# Altium schematic sheet ScheBTL.SchDoc
size A4; SheetNumber: 1; SheetTotal: 1
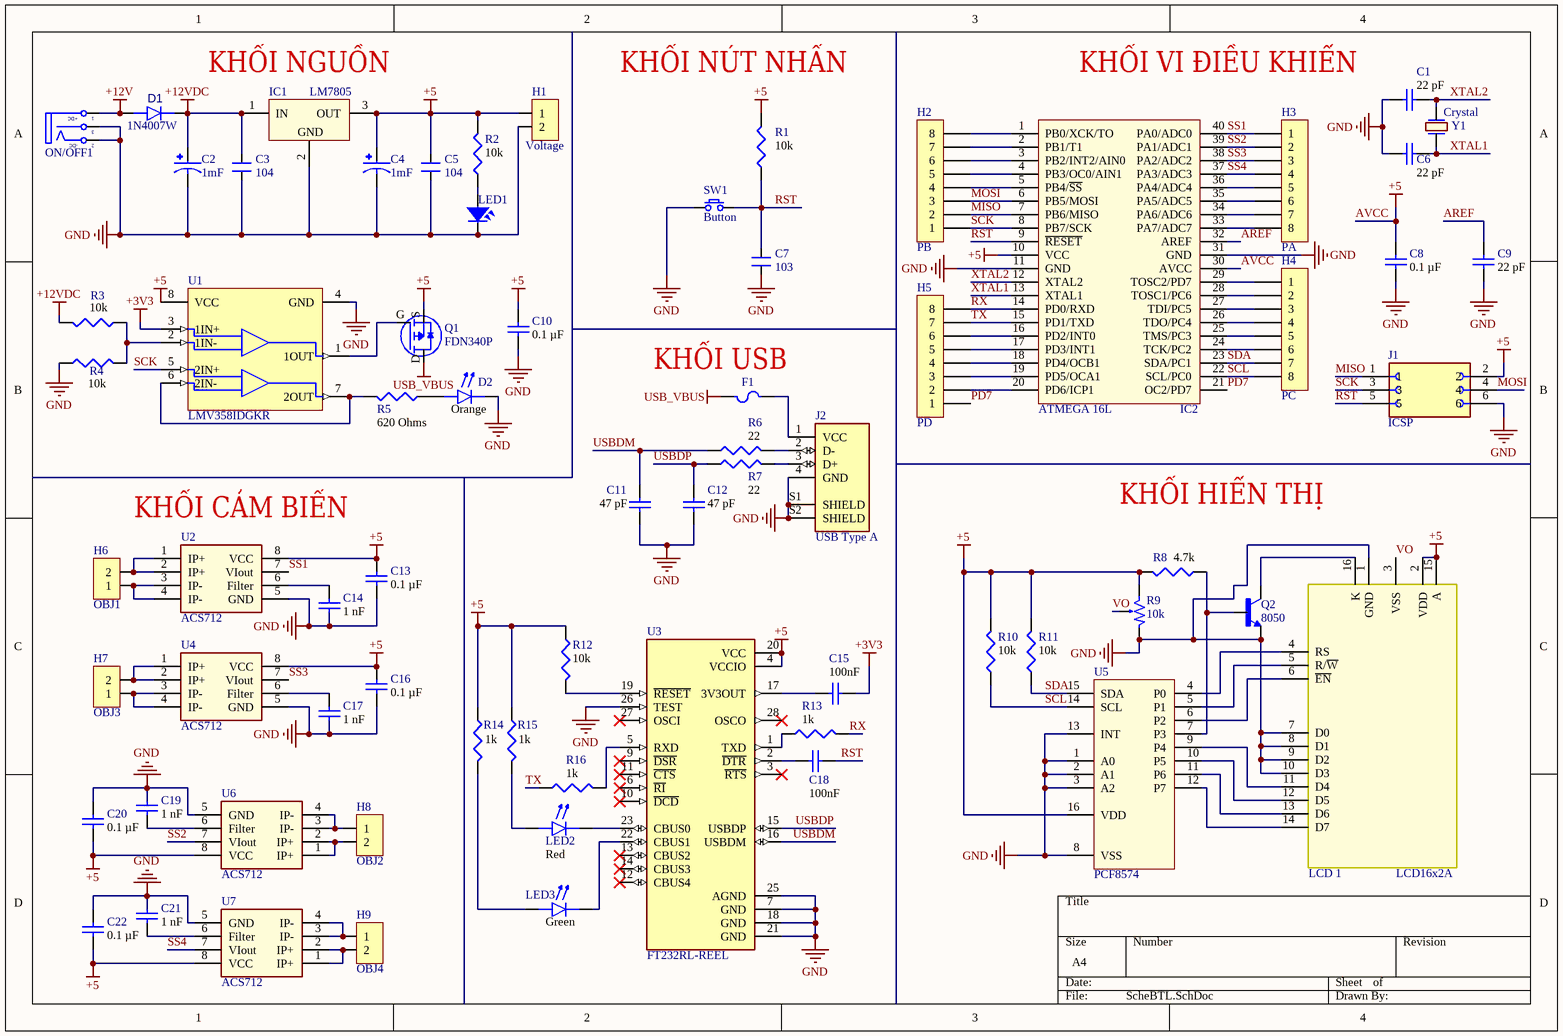
[diagram p0: ScheBTL.SchDoc]

## Parts
C1  Capacitance: 22 pF  [0805 (2012 Metric)]  (hidden comment: Capacitor)
C2  1mF  [CAP_16SVPF1000M]
C3  104  [CN2]
C4  1mF  [CAP_16SVPF1000M]
C5  104  [CN2]
C6  Capacitance: 22 pF  [0805 (2012 Metric)]  (hidden comment: Capacitor)
C7  103  [CN1.5]
C8  Capacitance: 0.1 µF  [0805 (2012 Metric)]  (hidden comment: Capacitor)
C9  Capacitance: 22 pF  [0805 (2012 Metric)]  (hidden comment: Capacitor)
C10  Capacitance: 0.1 µF  [0805 (2012 Metric)]  (hidden comment: Capacitor)
C11  Capacitance: 47 pF  [0805 (2012 Metric)]  (hidden comment: Capacitor)
C12  Capacitance: 47 pF  [0805 (2012 Metric)]  (hidden comment: Capacitor)
C13  Capacitance: 0.1 µF  [0805 (2012 Metric)]  (hidden comment: Capacitor)
C14  Capacitance: 1 nF  [0805 (2012 Metric)]  (hidden comment: Capacitor)
C15  Capacitance: 100nF  [0805 (2012 Metric)]  (hidden comment: Capacitor)
C16  Capacitance: 0.1 µF  [0805 (2012 Metric)]  (hidden comment: Capacitor)
C17  Capacitance: 1 nF  [0805 (2012 Metric)]  (hidden comment: Capacitor)
C18  Capacitance: 100nF  [0805 (2012 Metric)]  (hidden comment: Capacitor)
C19  Capacitance: 1 nF  [0805 (2012 Metric)]  (hidden comment: Capacitor)
C20  Capacitance: 0.1 µF  [0805 (2012 Metric)]  (hidden comment: Capacitor)
C21  Capacitance: 1 nF  [0805 (2012 Metric)]  (hidden comment: Capacitor)
C22  Capacitance: 0.1 µF  [0805 (2012 Metric)]  (hidden comment: Capacitor)
D1  Part Number: 1N4007W  [DO-204AL, DO-41, Axial]  (hidden comment: Diode)
D2  Color: Orange  [0805 (2012 Metric) Orange]  (hidden comment: LED Indication - Discrete)
F1  Fuse  [1812 (4532 Metric), Concave]  (value not drawn)
H1  Voltage  [Wire to Board, Pitch 5.00mm]
H2  PB  [Female, Through Hole, Pitch 2.54mm]
H3  PA  [Female, Through Hole, Pitch 2.54mm]
H4  PC  [Female, Through Hole, Pitch 2.54mm]
H5  PD  [Female, Through Hole, Pitch 2.54mm]
H6  OBJ1  [Wire to Board, Pitch 5.00mm]
H7  OBJ3  [Wire to Board, Pitch 5.00mm]
H8  OBJ2  [Wire to Board, Pitch 5.00mm]
H9  OBJ4  [Wire to Board, Pitch 5.00mm]
IC1  LM7805  [QTO-220]
IC2  ATMEGA 16L  [DIP40/W0.6]
J1  ICSP  [SULLINS_PPTC032LFBN-RC]
J2  USB Type A  [GCT_USB1130-15-A_REVA]
LCD_1  LCD16x2A  [LCD16X2]
LED1  LED  [LED-3]  (value not drawn)
LED2  Color: Red  [0805 (2012 Metric) Red]  (hidden comment: LED Indication - Discrete)
LED3  Color: Green  [0805 (2012 Metric) Green]  (hidden comment: LED Indication - Discrete)
ON/OFF1  POWER  [DC-IN]  (value not drawn)
Q1  Part Number: FDN340P  [TO-236-3, SC-59, SOT-23-3]  (hidden comment: Mosfet)
Q2  8050  [TRANS_SS8050-G]
R1  Resistance: 10k  [0805 (2012 Metric)]  (hidden comment: Resistor)
R2  Resistance: 10k  [0805 (2012 Metric)]  (hidden comment: Resistor)
R3  Resistance: 10k  [0805 (2012 Metric)]  (hidden comment: Resistor)
R4  Resistance: 10k  [0805 (2012 Metric)]  (hidden comment: Resistor)
R5  Resistance: 620 Ohms  [0805 (2012 Metric)]  (hidden comment: Resistor)
R6  Resistance: 22  [0805 (2012 Metric)]  (hidden comment: Resistor)
R7  Resistance: 22  [0805 (2012 Metric)]  (hidden comment: Resistor)
R8  Resistance: 4.7k  [0805 (2012 Metric)]  (hidden comment: Resistor)
R9  10k  [VR]
R10  Resistance: 10k  [0805 (2012 Metric)]  (hidden comment: Resistor)
R11  Resistance: 10k  [0805 (2012 Metric)]  (hidden comment: Resistor)
R12  Resistance: 10k  [0805 (2012 Metric)]  (hidden comment: Resistor)
R13  Resistance: 1k  [0805 (2012 Metric)]  (hidden comment: Resistor)
R14  Resistance: 1k  [0805 (2012 Metric)]  (hidden comment: Resistor)
R15  Resistance: 1k  [0805 (2012 Metric)]  (hidden comment: Resistor)
R16  Resistance: 1k  [0805 (2012 Metric)]  (hidden comment: Resistor)
SW1  Button  [SW/2/DIP]
U1  Part Number: LMV358IDGKR  [8-TSSOP, 8-MSOP]  (hidden comment: LMV358)
U2  ACS712  [SOIC-8]
U3  FT232RL-REEL  [SOP65P780X200-28N]
U4  ACS712  [SOIC-8]
U5  PCF8574  [SO16/PCF8574AT]
U6  ACS712  [SOIC-8]
U7  ACS712  [SOIC-8]
Y1  Crystal  [Crystal HC49S DIP]

## Nets
+3V3: C15.1 U1.3(1IN+)
+12V: D1.2(A) ON/OFF1.1(T)
+12VDC: C2.1 C3.2 D1.1(K) IC1.1(IN) R3.2
AVCC: C4.1 C5.2 C8.2 C10.2 C13.2 C16.2 C20.1 C22.1 H1.1 IC1.3(OUT) IC2.10(VCC) IC2.30(AVCC) J1.2 LCD_1.2(VDD) LCD_1.15(A) Q1.S R1.2 R2.2 R8.2 R9.3 R10.2 R11.2 R12.1 R14.1 R15.1 U1.8(VCC) U2.8(VCC) U3.4(VCCIO) U3.20(VCC) U4.8(VCC) U5.16(VDD) U6.8(VCC) U7.8(VCC)  [also labelled +5]
GND: C1.2 C2.2 C3.1 C4.2 C5.1 C6.2 C7.1 C8.1 C9.1 C10.1 C11.1 C12.1 C13.1 C14.1 C16.1 C17.1 C19.2 C20.2 C21.2 C22.2 D2.1(K) H1.2 IC1.2(GND) IC2.11(GND) IC2.31(GND) J1.6 J2.4(GND) J2.S1(SHIELD) J2.S2(SHIELD) LCD_1.1(GND) LCD_1.7(D0) LCD_1.8(D1) LCD_1.9(D2) LCD_1.10(D3) LED1.2 ON/OFF1.2(TN) ON/OFF1.3(S) Q2.2(E) R4.1 R9.1 SW1.1 U1.4(GND) U2.5(GND) U3.7(GND) U3.18(GND) U3.21(GND) U3.25(AGND) U3.26(TEST) U4.5(GND) U5.1(A0) U5.2(A1) U5.3(A2) U5.8(VSS) U5.13(INT) U6.5(GND) U7.5(GND)
USB_VBUS: F1.1 Q1.D
AREF: C9.2 IC2.32(AREF)
MISO: H2.2 IC2.7(PB6/MISO) J1.1
MOSI: H2.3 IC2.6(PB5/MOSI) J1.4
PD7: H5.1 IC2.21(OC2/PD7)
RST: C7.2 C18.1 IC2.9(~{RESET}) J1.5 R1.1 SW1.2
RX: H5.8 IC2.14(PD0/RXD) R13.2
SCK: H2.1 IC2.8(PB7/SCK) J1.3 U1.5(2IN+)
SCL: H4.8 IC2.22(SCL/PC0) R10.1 U5.14(SCL)
SDA: H4.7 IC2.23(SDA/PC1) R11.1 U5.15(SDA)
SS1: H3.1 IC2.40(PA0/ADC0) U2.7(VIout)
SS2: H3.2 IC2.39(PA1/ADC1) U6.7(VIout)
SS3: H3.3 IC2.38(PA2/ADC2) U4.7(VIout)
SS4: H3.4 IC2.37(PA3/ADC3) U7.7(VIout)
TX: H5.7 IC2.15(PD1/TXD) R16.1
USBDM: C11.2 R6.1 U3.16(USBDM)
USBDP: C12.2 R7.1 U3.15(USBDP)
VO: LCD_1.3(VSS) R9.2
XTAL1: C6.1 IC2.13(XTAL1) Y1.1
XTAL2: C1.1 IC2.12(XTAL2) Y1.2
NetC14_2: C14.2 U2.6(Filter)
NetC15_2: C15.2 U3.17(3V3OUT)
NetC17_2: C17.2 U4.6(Filter)
NetC18_2: C18.2 U3.2(~{DTR})
NetC19_1: C19.1 U6.6(Filter)
NetC21_1: C21.1 U7.6(Filter)
NetD2_2: D2.2(A) R5.1
NetF1_2: F1.2 J2.1(VCC)
NetH2_4: H2.4 IC2.5(PB4/~{SS})
NetH2_5: H2.5 IC2.4(PB3/OC0/AIN1)
NetH2_6: H2.6 IC2.3(PB2/INT2/AIN0)
NetH2_7: H2.7 IC2.2(PB1/T1)
NetH2_8: H2.8 IC2.1(PB0/XCK/TO)
NetH3_5: H3.5 IC2.36(PA4/ADC4)
NetH3_6: H3.6 IC2.35(PA5/ADC5)
NetH3_7: H3.7 IC2.34(PA6/ADC6)
NetH3_8: H3.8 IC2.33(PA7/ADC7)
NetH4_1: H4.1 IC2.29(TOSC2/PD7)
NetH4_2: H4.2 IC2.28(TOSC1/PC6)
NetH4_3: H4.3 IC2.27(TDI/PC5)
NetH4_4: H4.4 IC2.26(TDO/PC4)
NetH4_5: H4.5 IC2.25(TMS/PC3)
NetH4_6: H4.6 IC2.24(TCK/PC2)
NetH5_2: H5.2 IC2.20(PD6/ICP1)
NetH5_3: H5.3 IC2.19(PD5/OCA1)
NetH5_4: H5.4 IC2.18(PD4/OCB1)
NetH5_5: H5.5 IC2.17(PD3/INT1)
NetH5_6: H5.6 IC2.16(PD2/INT0)
NetH6_1: H6.1 U2.3(IP-) U2.4(IP-)
NetH6_2: H6.2 U2.1(IP+) U2.2(IP+)
NetH7_1: H7.1 U4.3(IP-) U4.4(IP-)
NetH7_2: H7.2 U4.1(IP+) U4.2(IP+)
NetH8_1: H8.1 U6.3(IP-) U6.4(IP-)
NetH8_2: H8.2 U6.1(IP+) U6.2(IP+)
NetH9_1: H9.1 U7.3(IP-) U7.4(IP-)
NetH9_2: H9.2 U7.1(IP+) U7.2(IP+)
NetJ2_2: J2.2(D-) R6.2
NetJ2_3: J2.3(D+) R7.2
NetLCD_1_4: LCD_1.4(RS) U5.4(P0)
NetLCD_1_5: LCD_1.5(R/~{W}) U5.5(P1)
NetLCD_1_6: LCD_1.6(~{EN}) U5.6(P2)
NetLCD_1_11: LCD_1.11(D4) U5.9(P4)
NetLCD_1_12: LCD_1.12(D5) U5.10(P5)
NetLCD_1_13: LCD_1.13(D6) U5.11(P6)
NetLCD_1_14: LCD_1.14(D7) U5.12(P7)
NetLCD_1_16: LCD_1.16(K) Q2.3(C)
NetLED1_1: LED1.1 R2.1
NetLED2_1: LED2.1(K) U3.23(CBUS0)
NetLED2_2: LED2.2(A) R15.2
NetLED3_1: LED3.1(K) U3.22(CBUS1)
NetLED3_2: LED3.2(A) R14.2
NetQ1_G: Q1.G U1.1(1OUT)
NetQ2_1: Q2.1(B) R8.1 U5.7(P3)
NetR3_1: R3.1 R4.2 U1.2(1IN-)
NetR5_2: R5.2 U1.6(2IN-) U1.7(2OUT)
NetR12_2: R12.2 U3.19(~{RESET})
NetR13_1: R13.1 U3.1(TXD)
NetR16_2: R16.2 U3.5(RXD)

Not connected (* = marked no-connect by the designer): U3 3(~{RTS})* 6(~{RI})* 9(~{DSR})* 10(~{DCD})* 11(~{CTS})* 12(CBUS4)* 13(CBUS2)* 14(CBUS3)* 27(OSCI)* 28(OSCO)*

## Notes on the sheet
- KHỐI NGUỒN
- (near R1) KHỐI NÚT NHẤN
- KHỐI VI ĐIỀU KHIỂN
- (near F1) KHỐI USB
- KHỐI CẢM BIẾN
- KHỐI HIỂN THỊ
- (in symbol DCIN) +DC; -DC

## Library data of the parts
C1 C6 C8-C22 = CMP-001-00085-18: Oreki; Capacitor Type: non-polarity; Voltage - Rated: 16V; Tolerance: ±20%; Pins: 2; ComponentLink1Description: DigiKey; Component Type: Capacitors
C2 C4 = 16SVPF1000M: MP: 16SVPF1000M; Package: None; Availability: Unavailable; Price: None; Value: *
C3 C5 = CN2: Cap np 104 => 105pF; Value: 0.1uF
C7 = CN1.5: Cap np 682pF => 104pF; Value: 0.01uF
D1 = CMP-004-00033-6: Oreki; Current - Average Rectified (Io): 1A; Capacitance @ Vr, F: 15pF @ 4V, 1MHz; Voltage - DC Reverse (Vr) (Max): 1000 V; Voltage - Forward (Vf) (Max) @ If: 1.1 V @ 1 A; ComponentLink1Description: DigiKey; JLCPCB Part #: C108803; Component Type: Diodes
D2 LED2 LED3 = CMP-007-00046-2: Oreki; Part Number: 17-21SURC/S530-A3/4T; ComponentLink1Description: DigiKey; JLCPCB Part #: C2943978; Component Type: LED
F1 = CMP-005-00015-2: Oreki; Part Number: MF-MSMF050-2; Voltage - Max: 15V; Current - Hold (Ih) (Max): 500 mA; Current - Trip (It): 1 A; Current - Max: 100 A; Time to Trip: 150 ms; Resistance - Initial (Ri) (Min): 150 mOhms; Resistance - Post Trip (R1) (Max): 1 Ohms; ComponentLink1Description: DigiKey; JLCPCB Part #: C17313; Component Type: Fuses
H1 H6-H9 = CMP-002-00093-4: Oreki; ComponentLink1Description: DigiKey; ComponentLink2Description: thegioiic; Component Type: Connectors
H2-H5 = CMP-002-00073-4: Oreki; ComponentLink1Description: DigiKey; ComponentLink2Description: thegioiic; Pins: 8; Component Type: Connectors
IC1 = LM78xx: On ap +, from + 5 to + 24VDC; Value: LM7805
IC2 = Atmega16L: 8-Bit AVR Microcontroller with 16K Bytes of In-System Programmable Flash Memory; Value: Atmega 16L
J1 = PPTC032LFBN-RC: 6 Position Header Connector 0.100 (2.54mm) Through Hole Tin; MF: Sullins Connector Solutions; Package: None; Price: None; Value: *; SnapEDA_Link: https://www.snapeda.com/parts/PPTC032LFBN-RC/Sullins+Connector+Solutions/view-part/?ref=snap; MP: PPTC032LFBN-RC; Availability: Not in stock; Check_prices: https://www.snapeda.com/parts/PPTC032LFBN-RC/Sullins+Connector+Solutions/view-part/?ref=eda
J2 = USB1130-15-A_REVA: USB 2.0 Connector Full size Horizontal Plug, type A, 4 Pins, Through hole, Top mount, 6.99mm profile, High mating cycle, charging receptacle; MF: Global Connector Technology; Price: None; Availability: In Stock; Package: None; MP: USB1130-15-A; Value: *; SnapEDA_Link: https://www.snapeda.com/parts/USB1130-15-A/Global+Connector+Technology/view-part/?ref=snap; Purchase-URL: https://pricing.snapeda.com/search/part/USB1130-15-A/?ref=eda; Check_prices: https://www.snapeda.com/parts/USB1130-15-A/Global+Connector+Technology/view-part/?ref=eda
LCD_1 = LCD16x2: LCD dipslay 16 char, 2 line; Value: LCD16x2A
LED1 = LED: LED Single colour Green and Red; Value: LED 3 ly Single Colour
ON/OFF1 = DCIN
Q1 = CMP-013-00039-7: Oreki; Current - Continuous Drain (Id) @ 25°C: 2A (Ta); Rds On (Max) @ Id, Vgs: 70mOhm @ 2A, 4.5V; Vgs(th) (Max) @ Id: 1.5V @ 250µA; ComponentLink1Description: DigiKey; Component Type: Transistors
Q2 = SS8050-G: Bipolar (BJT) Transistor NPN 25 V 1.5 A 100MHz 300 mW Surface Mount SOT-23-3; MP: SS8050G; MF: Comchip; Digi-Key_Part_Number: 641-1790-2-ND; Check_prices: https://www.snapeda.com/parts/SS8050G/Comchip/view-part/?ref=eda; Package: None; SnapEDA_Link: https://www.snapeda.com/parts/SS8050G/Comchip/view-part/?ref=snap; Value: *
R1-R8 R10-R16 = CMP-009-00179-11: Oreki; Tolerance: ±5%; Power: 0.125W, 1/8W; Mounting Technology: SMT; Case/Package: Chip; ComponentLink1Description: DigiKey; Pins: 2; RoHS Compliant: Yes; Component Type: Resistors
R9 = VR1: Var Resistor; Value: VR 10K
SW1 = SW SPST: Tact switch 2 pin
U1 = CMP-031-00028-4: Oreki; JLCPCB Part #: C5145253; ComponentLink1Description: DigiKey; Component Type: Integrated Circuits
U2 U4 U6 U7 = ACS712: Fully Integrated, Hall Effect-Based Linear Current Sensor IC   with 2.1 kVRMS Isolation and a Low-Resistance Current Conductor
U3 = FT232RL-REEL: USB Bridge, USB to UART USB 2.0 UART Interface 28-SSOP; MF: FTDI,; Check_prices: https://www.snapeda.com/parts/FT232RL-REEL/FTDI%252C+Future+Technology+Devices+International+Ltd/view-part/?ref=eda; Purchase-URL: https://pricing.snapeda.com/search/part/FT232RL-REEL/?ref=eda; Price: None; SnapEDA_Link: https://www.snapeda.com/parts/FT232RL-REEL/FTDI%252C+Future+Technology+Devices+International+Ltd/view-part/?ref=snap; Availability: In Stock; Package: SSOP-28 FTDI; MP: FT232RL-REEL; Value: *
U5 = PCF8574AT: Remote 8-bit I/O expander for I2C-bus with interrupt; PART NO: PCF8574AT/3; BRAND: NXP; PACKAGE: SO16; TYPE: SMD
Y1 = Crystal: Value: 8MHz